# EAGLE design monitor-one-io-card-v0.0.4 (EAGLE 9.6.2)
Assembly variants: proto-click

## Sheet 1 of 2: SYSTEM BLOCK DIAGRAM
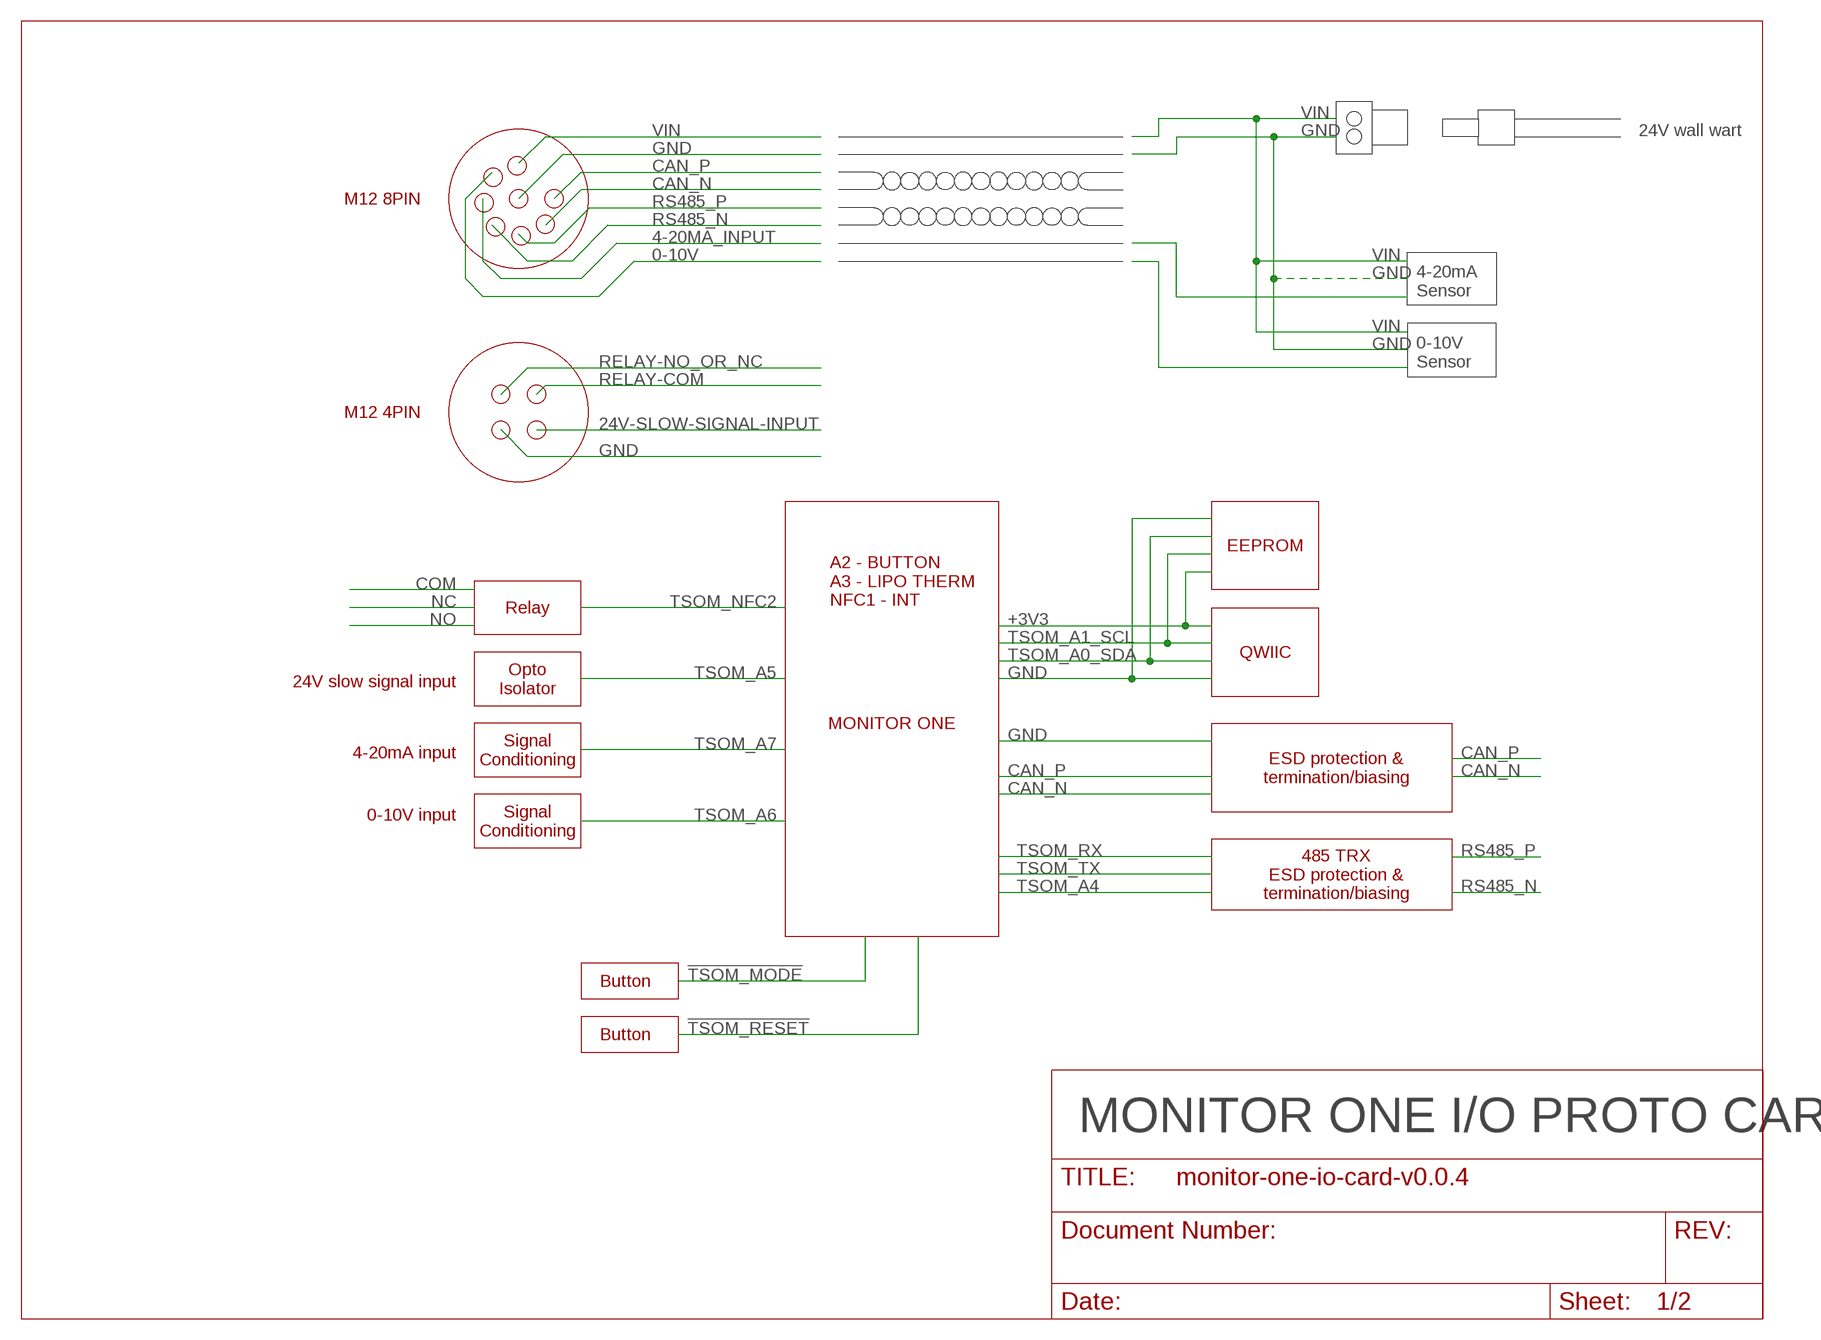
[diagram p0: schematic, sheet 1]

### Notes on the sheet
- 24V wall wart
- M12 8PIN
- 4-20mA
  Sensor
- 0-10V
  Sensor
- M12 4PIN
- EEPROM
- A2 - BUTTON
  A3 - LIPO THERM
  NFC1 - INT
- Relay
- QWIIC
- Opto
  Isolator
- 24V slow signal input
- MONITOR ONE
- Signal
  Conditioning
- 4-20mA input
- ESD protection &
  termination/biasing
- 0-10V input
- Signal
  Conditioning
- 485 TRX
  ESD protection &
  termination/biasing
- Button
- Button
- MONITOR ONE I/O PROTO CARD

## Sheet 2 of 2
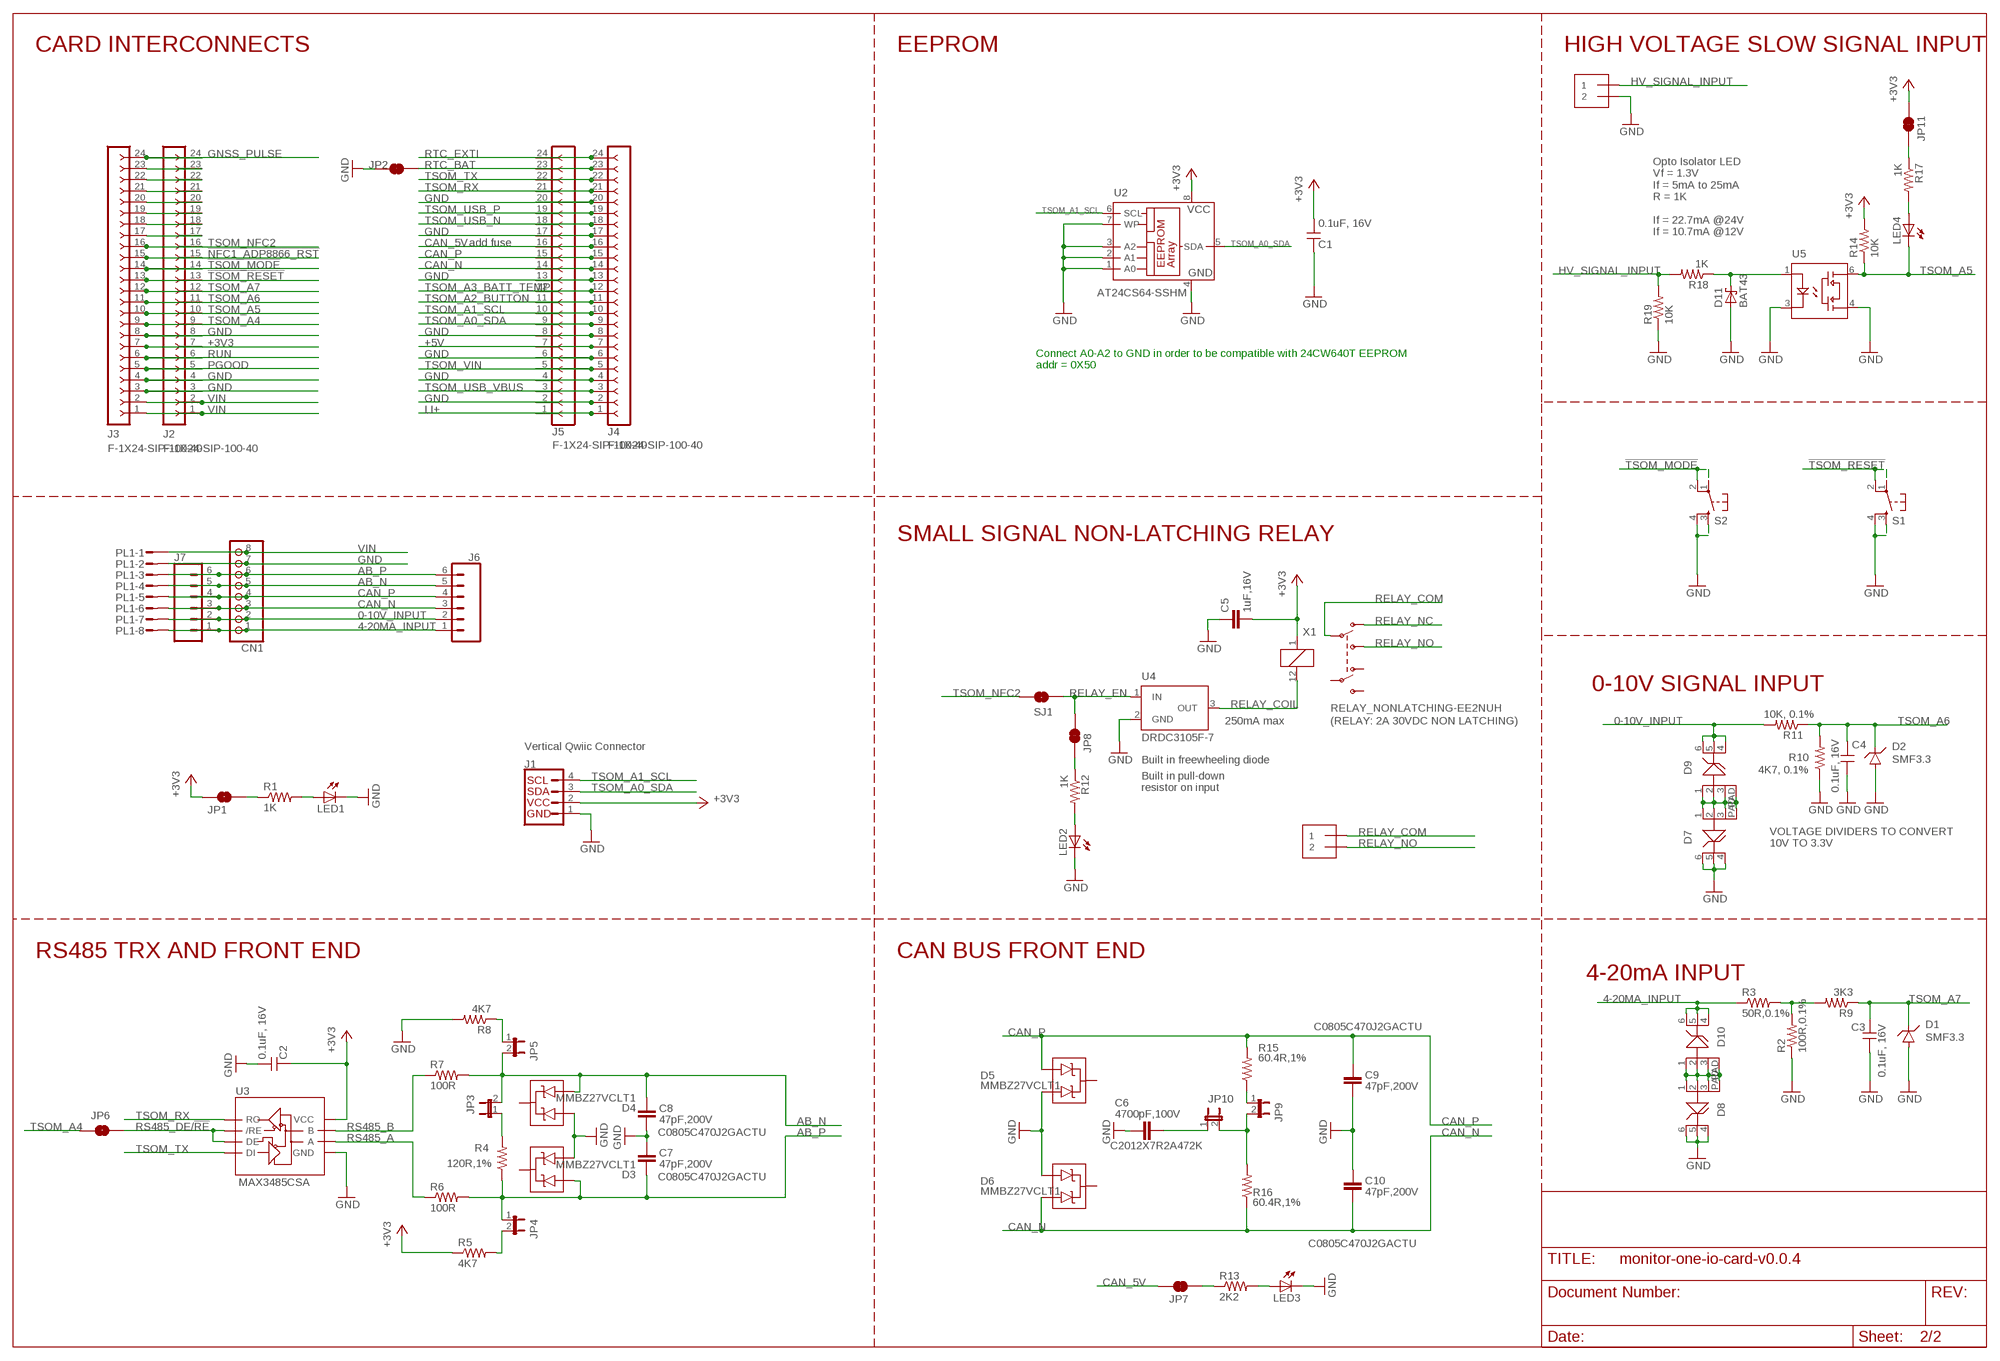
[diagram p1: schematic, sheet 2]

### Parts
C1  0.1uF, 16V  CAP_0.1UF_16V_0603  [C0603_P]  (not fitted in variant proto-click)
C2  0.1uF, 16V  CAP_0.1UF_16V_0603  [C0603_P]
C3  0.1uF, 16V  CAP_0.1UF_16V_0603  [C0603_P]
C4  0.1uF, 16V  CAP_0.1UF_16V_0603  [C0603_P]
C5  1uF,16V  C-EUC0805  [C0805]
C6  4700pF,100V  C-EUC0805  [C0805]  (not fitted in variant proto-click)
C7  47pF,200V  C-EUC0805  [C0805]
C8  47pF,200V  C-EUC0805  [C0805]
C9  47pF,200V  C-EUC0805  [C0805]
C10  47pF,200V  C-EUC0805  [C0805]
CN1  JST_8PIN  [JSTPH8]
D1  SMF3.3  TVS-DIODE-SOD123FL  [SOD-123FL]
D2  SMF3.3  TVS-DIODE-SOD123FL  [SOD-123FL]
D3  MMBZ27VCLT1  [SOT23-3]
D4  MMBZ27VCLT1  [SOT23-3]
D5  MMBZ27VCLT1  [SOT23-3]
D6  MMBZ27VCLT1  [SOT23-3]
D7  TVS3300DRVRNO-GND-VIAS  [WSON-6-NO-GND-VIAS]
D8  TVS3300DRVRNO-GND-VIAS  [WSON-6-NO-GND-VIAS]
D9  TVS3300DRVRNO-GND-VIAS  [WSON-6-NO-GND-VIAS]
D10  TVS3300DRVRNO-GND-VIAS  [WSON-6-NO-GND-VIAS]
D11  BAT43  SCHOTTKY_SOD-123  [SOD3718X135N]
J1  Vertical Qwiic Connector  QWIIC_CONNECTOR  [JST04_1MM_VERT]
J2  F-1X24-SIP-100-40  [SIP-100-24-40]
J3  F-1X24-SIP-100-40  [SIP-100-24-40]
J4  F-1X24-SIP-100-40  [SIP-100-24-40]
J5  F-1X24-SIP-100-40  [SIP-100-24-40]
J6  CONN_06NO_SILK_NO_POP  [1X06_NO_SILK]
J7  CONN_06NO_SILK_NO_POP  [1X06_NO_SILK]
J8  1X2-3.5MM  [1X2-3.5MM]
J9  1X2-3.5MM  [1X2-3.5MM]
JP1  JUMPER-SMT_2_NC_TRACE_NO-SILK  [SMT-JUMPER_2_NC_TRACE_NO-SILK]
JP2  JUMPER-SMT_2_NC_TRACE_NO-SILK  [SMT-JUMPER_2_NC_TRACE_NO-SILK]
JP3  JUMPER2  [JUMPER2]
JP4  JUMPER2  [JUMPER2]
JP5  JUMPER2  [JUMPER2]
JP6  JUMPER-SMT_2_NC_TRACE_NO-SILK  [SMT-JUMPER_2_NC_TRACE_NO-SILK]
JP7  JUMPER-SMT_2_NC_TRACE_NO-SILK  [SMT-JUMPER_2_NC_TRACE_NO-SILK]
JP8  JUMPER-SMT_2_NC_TRACE_NO-SILK  [SMT-JUMPER_2_NC_TRACE_NO-SILK]
JP9  JUMPER2  [JUMPER2]
JP10  JUMPER2  [JUMPER2]
JP11  JUMPER-SMT_2_NC_TRACE_NO-SILK  [SMT-JUMPER_2_NC_TRACE_NO-SILK]
LED1  LEDCHIP-LED0603  [CHIP-LED0603]
LED2  LEDCHIP-LED0603  [CHIP-LED0603]
LED3  LEDCHIP-LED0603  [CHIP-LED0603]
LED4  LEDCHIP-LED0603  [CHIP-LED0603]
PL1  DF3-08R  [DF3R-08]
R1  1K  RES_1K_0603  [R0603_P]
R2  100R,0.1%  R-US_R0805  [R0805]
R3  50R,0.1%  R-US_R0805  [R0805]
R4  120R,1%  R-US_R1206  [R1206]
R5  4K7  RES_4K7_0603  [R0603_P]  (not fitted in variant proto-click)
R6  100R  RES_0603  [R0603_P]
R7  100R  RES_0603  [R0603_P]
R8  4K7  RES_4K7_0603  [R0603_P]  (not fitted in variant proto-click)
R9  3K3  RES_0603  [R0603_P]
R10  4K7, 0.1%  RES_0603  [R0603_P]
R11  10K, 0.1%  RES_10K_0603  [R0603_P]
R12  1K  RES_1K_0603  [R0603_P]
R13  2K2  RES_2K2_0603  [R0603_P]
R14  10K  RES_10K_0603  [R0603_P]
R15  60.4R,1%  R-US_R1206  [R1206]  (not fitted in variant proto-click)
R16  60.4R,1%  R-US_R1206  [R1206]  (not fitted in variant proto-click)
R17  1K  RES_1K_0603  [R0603_P]
R18  1K  RES_1K_0603  [R0603_P]
R19  10K  RES_10K_0603  [R0603_P]
S1  TAC_SWITCHSMD  [TACTILE_SWITCH_SMD]
S2  TAC_SWITCHSMD  [TACTILE_SWITCH_SMD]
SJ1  JUMPER-SMT_2_NC_TRACE_NO-SILK  [SMT-JUMPER_2_NC_TRACE_NO-SILK]
U2  AT24CS64-SSHM  24AA01SN  [SO-08]  (not fitted in variant proto-click)
U3  MAX3485CSA  RS485SOIC  [SO08]
U4  DRDC3105F-7  [SOT23]
U5  U5  TLP172AM  [TLP172A]
X1  RELAY_NONLATCHING-EE2NUH  [RELAY_EE2_NOLATCH]

### Nets
0-10V_INPUT: CN1.2 D9.4(IN) D9.5(IN) D9.6(IN) J6.2 J7.2 PL1.7 R11.2
4-20MA_INPUT: CN1.1 D10.4(IN) D10.5(IN) D10.6(IN) J6.1 J7.1 PL1.8 R3.1 ; also sheet 1
!NFC1_ADP8866_RST: J2.15 J3.15
!TSOM_MODE: J2.14 J3.14 S2.1 S2.2 ; also sheet 1
!TSOM_RESET: J2.13 J3.13 S1.1 S1.2 ; also sheet 1
+3V3: C1.1 C2.2 C5.2 J1.2 J2.7 J3.7 JP1.1 JP11.2 R5.1 R14.2 U2.8(VCC) U3.8(VCC) X1.1 ; also sheet 1
+5V: J4.7 J5.7
AB_N: C8.1 CN1.5 D4.1(A1) J6.5 J7.5 JP3.2 JP5.2 PL1.4 R7.2
AB_P: C7.2 CN1.6 D3.2(A2) J6.6 J7.6 JP4.1 PL1.3 R4.1 R6.2
CAN_5V: J4.16 J5.16 JP7.1
CAN_N: C10.2 CN1.3 D6.1(A1) J4.14 J5.14 J6.3 J7.3 PL1.6 R16.1 ; also sheet 1
CAN_P: C9.1 CN1.4 D5.2(A2) J4.15 J5.15 J6.4 J7.4 PL1.5 R15.2 ; also sheet 1
GND: C1.2 C2.1 C3.1 C4.2 C5.1 C6.1 C7.1 C8.2 C9.2 C10.1 CN1.7 D1.A D2.A D3.1(A1) D4.2(A2) D5.1(A1) D6.2(A2) D7.4(IN) D7.5(IN) D7.6(IN) D8.4(IN) D8.5(IN) D8.6(IN) D11.A J1.1 J2.3 J2.4 J2.8 J3.3 J3.4 J3.8 J4.2 J4.4 J4.6 J4.8 J4.13 J4.17 J4.20 J5.2 J5.4 J5.6 J5.8 J5.13 J5.17 J5.20 J8.2 JP2.1 LED1.C LED2.C LED3.C PL1.2 R2.1 R8.2 R10.1 R19.1 S1.3 S1.4 S2.3 S2.4 U2.1(A0) U2.2(A1) U2.3(A2) U2.4(GND) U2.7(WP) U3.5(GND) U4.2(GND) U5.3 U5.4 ; also sheet 1
GNSS_PULSE: J2.24 J3.24
HV_SIGNAL_INPUT: J8.1 R18.2 R19.2
LI+: J4.1 J5.1
N$1: JP1.2 R1.1
N$2: JP7.2 R13.1
N$3: J2.17 J3.17
N$4: J2.18 J3.18
N$5: J2.19 J3.19
N$6: J2.20 J3.20
N$7: J2.21 J3.21
N$8: J2.22 J3.22
N$9: J2.23 J3.23
N$10: R2.2 R3.2 R9.2
N$11: LED1.A R1.2
N$12: LED3.A R13.2
N$16: JP9.2 JP10.2 R16.2
N$47: JP4.2 R5.2
N$49: JP9.1 R15.1
N$59: JP5.1 R8.1
N$72: JP3.1 R4.2
N$74: D11.K R18.1 U5.1
N$75: LED2.A R12.2
N$76: JP8.1 R12.1
N$77: LED4.A R17.2
N$78: JP11.1 R17.1
N$134: C6.2 JP10.1
N$169: D8.1(GND) D8.2(GND) D8.3(GND) D8.PAD D10.1(GND) D10.2(GND) D10.3(GND) D10.PAD
N$170: D7.1(GND) D7.2(GND) D7.3(GND) D7.PAD D9.1(GND) D9.2(GND) D9.3(GND) D9.PAD
PGOOD: J2.5 J3.5
RELAY_COIL: U4.3(OUT) X1.12
RELAY_COM: J9.1 X1.9(SW:P1)
RELAY_EN: JP8.2 SJ1.1 U4.1(IN)
RELAY_NC: X1.10(SW:O1)
RELAY_NO: J9.2 X1.8(SW:S1)
RS485_A: R6.1 U3.6(A)
RS485_B: R7.1 U3.7(B)
RS485_DE/!RE: JP6.2 U3.2(/RE) U3.3(DE)
RTC_BAT: J4.23 J5.23 JP2.2
RTC_EXTI: J4.24 J5.24
RUN: J2.6 J3.6
TSOM_A0_SDA: J1.3 J4.9 J5.9 U2.5(SDA) ; also sheet 1
TSOM_A1_SCL: J1.4 J4.10 J5.10 U2.6(SCL) ; also sheet 1
TSOM_A2_BUTTON: J4.11 J5.11
TSOM_A3_BATT_TEMP: J4.12 J5.12
TSOM_A4: J2.9 J3.9 JP6.1 ; also sheet 1
TSOM_A5: J2.10 J3.10 LED4.C R14.1 U5.6 ; also sheet 1
TSOM_A6: C4.1 D2.C J2.11 J3.11 R10.2 R11.1 ; also sheet 1
TSOM_A7: C3.2 D1.C J2.12 J3.12 R9.1 ; also sheet 1
TSOM_NFC2: J2.16 J3.16 SJ1.2 ; also sheet 1
TSOM_RX: J4.21 J5.21 U3.1(RO) ; also sheet 1
TSOM_TX: J4.22 J5.22 U3.4(DI) ; also sheet 1
TSOM_USB_N: J4.18 J5.18
TSOM_USB_P: J4.19 J5.19
TSOM_USB_VBUS: J4.3 J5.3
TSOM_VIN: J4.5 J5.5
VIN: CN1.8 J2.1 J2.2 J3.1 J3.2 PL1.1 ; also sheet 1
Unconnected: D3.3(C) D4.3(C) D5.3(C) D6.3(C) X1.3(SW:O2) X1.4(SW:P2) X1.5(SW:S2)

### Notes on the sheet
- CARD INTERCONNECTS | EEPROM | HIGH VOLTAGE SLOW SIGNAL INPUT
- Opto Isolator LED
  Vf = 1.3V
  If = 5mA to 25mA
  R = 1K
  
  If = 22.7mA @24V
  If = 10.7mA @12V
- add fuse
- Connect A0-A2 to GND in order to be compatible with 24CW640T EEPROM
  addr = 0X50
- SMALL SIGNAL NON-LATCHING RELAY
- 0-10V SIGNAL INPUT
- 250mA max | (RELAY: 2A 30VDC NON LATCHING)
- Built in freewheeling diode
- Built in pull-down 
  resistor on input
- VOLTAGE DIVIDERS TO CONVERT
  10V TO 3.3V
- RS485 TRX AND FRONT END | CAN BUS FRONT END
- 4-20mA INPUT

## Library data of the parts
C1-C4 = particle-studios:CAP_: Particle Capacitors; DESP: CAP CER 0.1UF 16V X7R 0603; MFG: FENGHUA; MPN: 0603B104K160NT; PPN: PT-200082
C5 = rcl:C-EU: CAPACITOR, European symbol; SPICEPREFIX: C
C6 = rcl:C-EU: CAPACITOR, European symbol; PART_NUMBER: C2012X7R2A472K; SPICEPREFIX: C
C7 C8 = rcl:C-EU: CAPACITOR, European symbol; PART_NUMBER: C0805C470J2GACTU; SPICEPREFIX: C
C9 C10 = rcl:C-EU: CAPACITOR, European symbol; DESP: CAP CER 47PF 200V 0805; MFG: KEMET; MPN: C0805C470J2GACTU; PART_NUMBER: C0805C470J2GACTU; PPN: PT-201188; SPICEPREFIX: C
CN1 = microbuilder:JST_8PIN: JST 8-Pin Right-Angle Connector
D1 D2 = particle-studios:TVS-DIODE-SOD123
D3 D4 = SparkFun:MMBZ27VCLT1
D5 D6 = SparkFun:MMBZ27VCLT1; DESP: TVS DIODE 22V 38V SOT23-3; MFG: ON SEMI; MPN: MMBZ27VCLT1; PPN: PT-201202
D7-D10 = particle-studios:TVS3300DRVR: Texas Instruments 33V Flat-Clamp Surge Protection Device
D11 = ipc-7351-diode:SCHOTTKY_
J1 = SparkFun-Connectors:QWIIC_CONNECTOR: SparkFun I2C Standard Qwiic Connector An SMD 1mm pitch JST connector makes it easy and quick (get it? Qwiic?) to connect I2C devices to each other. The Qwiic system <http://www.sparkfun.com/qwiic> enables fast and solderless connection between popular platforms and various sensors and actuators. We carry 200mm <https://www.sparkfun.com/products/14204>, 100mm <https://www.sparkfun.com/products/14205>, 50mm <https://www.sparkfun.com/products/14206>, and breadboard friendly <https://www.sparkfun.com/products/14207> Qwiic cables. We also offer 10 pcs strips <https://www.sparkfun.com/products/14323> the SMD connectors.; PROD_ID: CONN-14483
J2-J5 = con-headers-jp:F-1X24-: FEMALE HEADER
J6 J7 = SparkFun-Connectors:CONN_06: Multi connection point. Often used as Generic Header-pin footprint for 0.1 inch spaced/style header connections On any of the 0.1 inch spaced packages, you can populate with these: Break Away Headers - Straight <https://www.sparkfun.com/products/116> (PRT-00116) Break Away Male Headers - Right Angle <https://www.sparkfun.com/products/553> (PRT-00553) Female Headers <https://www.sparkfun.com/products/115> (PRT-00115) Break Away Headers - Machine Pin <https://www.sparkfun.com/products/117> (PRT-00117) Break Away Female Headers - Swiss Machine Pin <https://www.sparkfun.com/products/743> (PRT-00743) Arduino Stackable Header - 6 Pin <https://www.sparkfun.com/products/9280> (PRT-09280) For SCREWTERMINALS and SPRING TERMINALS visit here: Screw Terimnals on SparkFun.com <https://www.sparkfun.com/search/results?term=Screw+Terminals> (5mm/3.5mm/2.54mm spacing) This device is also useful as a general connection point to wire up your design to another part of your project. Our various solder wires solder well into these plated through hole pads. Hook-Up Wire - Assortment (Stranded, 22 AWG) <https://www.sparkfun.com/products/11375> (PRT-11375) Hook-Up Wire - Assortment (Solid Core, 22 AWG) <https://www.sparkfun.com/products/11367> (PRT-11367) View the entire wire category on our website here <https://www.sparkfun.com/categories/141>
J8 J9 = adafruit:1X2: 3.5mm Terminal block http://www.ladyada.net/library/pcb/eaglelibrary.html
JP1 JP2 JP6-JP8 JP11 SJ1 = SparkFun-Jumpers:JUMPER-SMT_2_NC_TRACE: Normally closed trace jumper This jumper has a trace between two pads so it's normally closed (NC). Use a razor knife to open the connection. For best results follow the IPC guidelines for cutting traces: Cutout at least 0.063 mm (0.005 in). Remove all loose material to clean up the cut area. Seal the cut with an approved epoxy. Reapply solder to reclose the connection.
JP3-JP5 JP9 JP10 = microbuilder:JUMPER2: JUMPER - 2 Pins
LED1-LED4 = adafruit:LED: LED OSRAM: - CHIPLED LG R971, LG N971, LY N971, LG Q971, LY Q971, LO R971, LY R971 LH N974, LH R974 LS Q976, LO Q976, LY Q976 LO Q996 - Hyper CHIPLED LW Q18S LB Q993, LB Q99A, LB R99A - SideLED LS A670, LO A670, LY A670, LG A670, LP A670 LB A673, LV A673, LT A673, LW A673 LH A674 LY A675 LS A676, LA A676, LO A676, LY A676, LW A676 LS A679, LY A679, LG A679 - Hyper Micro SIDELED® LS Y876, LA Y876, LO Y876, LY Y876 LT Y87S - SmartLED LW L88C, LW L88S LB L89C, LB L89S, LG L890 LS L89K, LO L89K, LY L89K LS L896, LA L896, LO L896, LY L896 - TOPLED LS T670, LO T670, LY T670, LG T670, LP T670 LSG T670, LSP T670, LSY T670, LOP T670, LYG T670 LG T671, LOG T671, LSG T671 LB T673, LV T673, LT T673, LW T673 LH T674 LS T676, LA T676, LO T676, LY T676, LB T676, LH T676, LSB T676, LW T676 LB T67C, LV T67C, LT T67C, LS T67K, LO T67K, LY T67K, LW E67C LS E67B, LA E67B, LO E67B, LY E67B, LB E67C, LV E67C, LT E67C LW T67C LS T679, LY T679, LG T679 LS T770, LO T770, LY T770, LG T770, LP T770 LB T773, LV T773, LT T773, LW T773 LH T774 LS E675, LA E675, LY E675, LS T675 LS T776, LA T776, LO T776, LY T776, LB T776 LHGB T686 LT T68C, LB T68C - Hyper Mini TOPLED® LB M676 - Mini TOPLED Santana® LG M470 LS M47K, LO M47K, LY M47K Source: http://www.osram.convergy.de/
PL1 = con-hirose-df3:DF3-08: Single row connector 2mm 8 way
R1 R12 R17 R18 = particle-studios:RES_: Particle Resistors; DESP: RES SMD 1K OHM 1% 1/10W 0603; MFG: FENGHUA; MPN: RC-03K102FT; PPN: PT-200135
R2-R4 = rcl:R-US_: RESISTOR, American symbol; SPICEPREFIX: R
R5 R8 = particle-studios:RES_: Particle Resistors; DESP: RES SMD 4K7 OHM 1% 1/10W 0603; MFG: YAGEO; MPN: RC0603FR-074K7L; PPN: PT-201085
R6 R7 R9 R10 = particle-studios:RES_: Particle Resistors
R11 = particle-studios:RES_: Particle Resistors; DESP: RES SMD 10K OHM 1% 1/10W 0603; MFG: YAGEO; MPN: RC0603FR-0710KL; PPN: PT-200477; VALUE: 10K
R13 = particle-studios:RES_: Particle Resistors; DESP: RES SMD 2K2 OHM 1% 1/10W 0603
R14 R19 = particle-studios:RES_: Particle Resistors; DESP: RES SMD 10K OHM 1% 1/10W 0603; MFG: YAGEO; MPN: RC0603FR-0710KL; PPN: PT-200477
R15 R16 = rcl:R-US_: RESISTOR, American symbol; DESP: RES SMD 60.4 OHM 1% 1/4W 1206; SPICEPREFIX: R
S1 S2 = particle-studios:TAC_SWITCH: SMD Tactiile Switch
U2 = microchip:24*: Serial EEPROM I2C; MF: MICROCHIP; MPN: 24AA01/SN; OC_FARNELL: 1331268; OC_NEWARK: 89C9792
U3 = SparkFun-IC-Comms:RS485: RS-485 Transceiver SP3485 Series 8 Pin NSOIC 3.3 V Low Power Half Duplex RS-485 Transceiver MAX3485 compatible Datasheet <http://www.sparkfun.com/datasheets/Components/General/sp3485CN-LTR.pdf> SparkFun Products SparkFun Transceiver Breakout - RS-485 <https://www.sparkfun.com/products/10124> (BOB-10124) SparkFun USB to RS-485 Converter <https://www.sparkfun.com/products/9822> (BOB-09822); PROD_ID: IC-09388
U4 = particle-studios:DRDC3105F-7: IC PWR DRIVER BIPOLAR 1:1 SOT23
U5 = particle-studios:TLP172A: OPTO SSR RELAY SPST-NO 500MA 0-60V
X1 = microbuilder:RELAY_NONLATCHING

## Net classes
1 USB: width 0.483 mm, clearance 0.152 mm
3 CAN: width 0.483 mm, clearance 0.152 mm

## Board
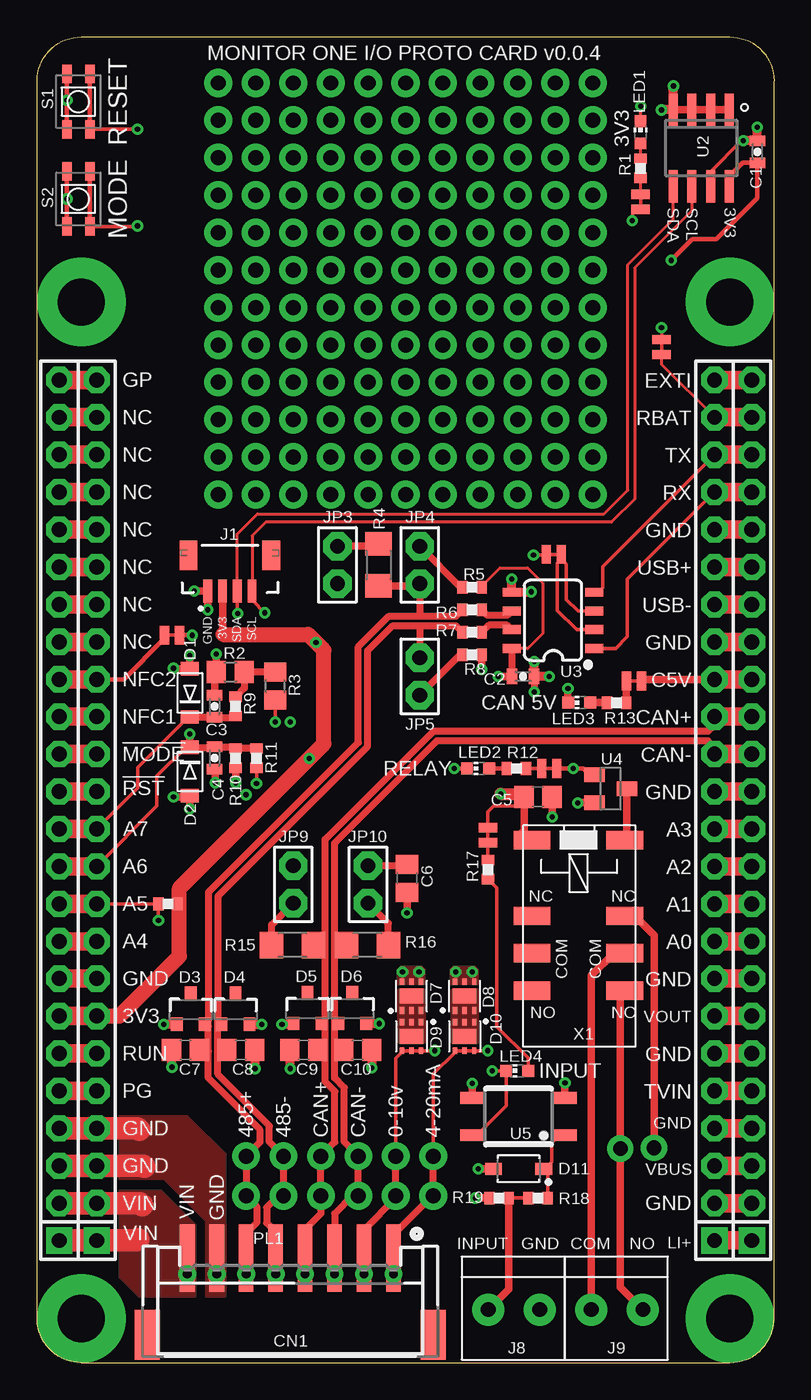
[diagram p2: board, top side]
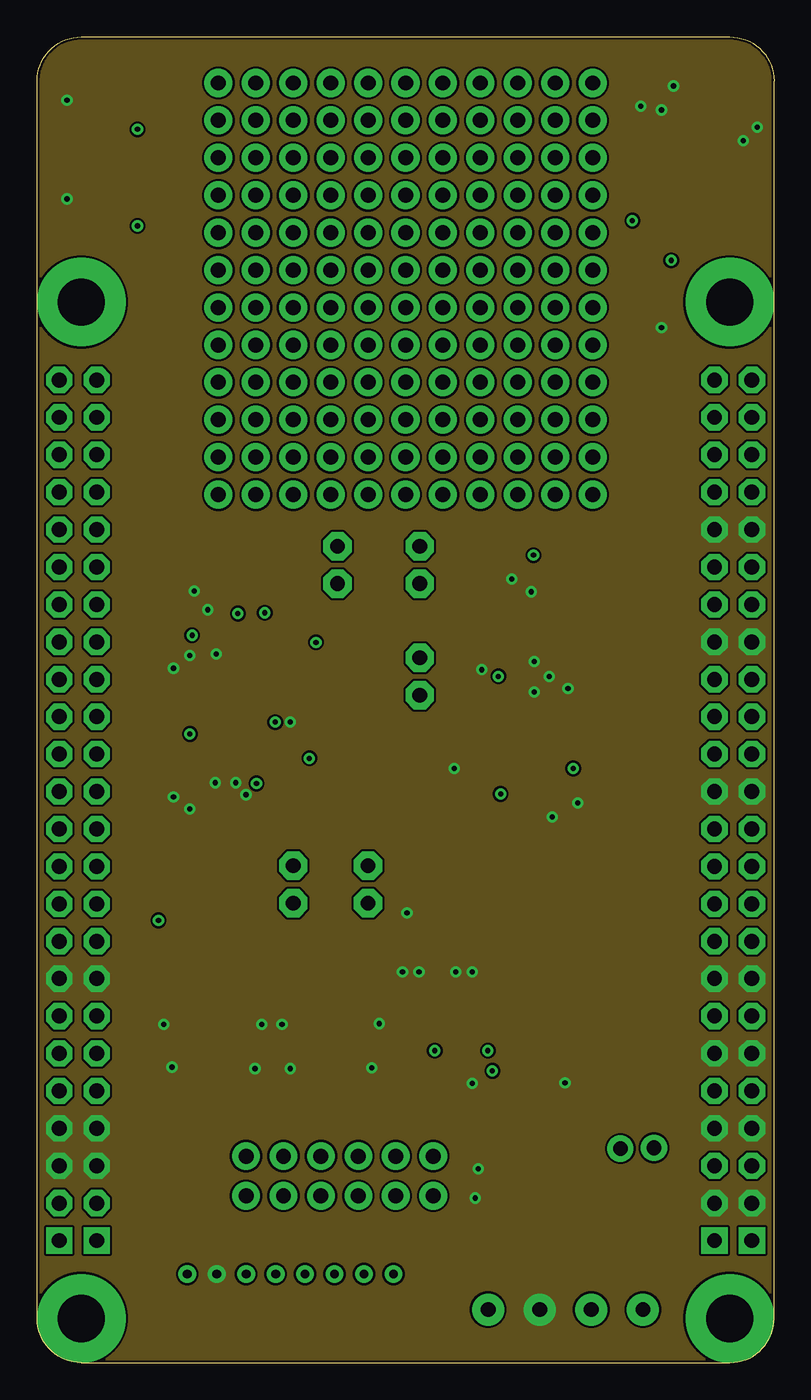
[diagram p3: board, inner layer Route2]
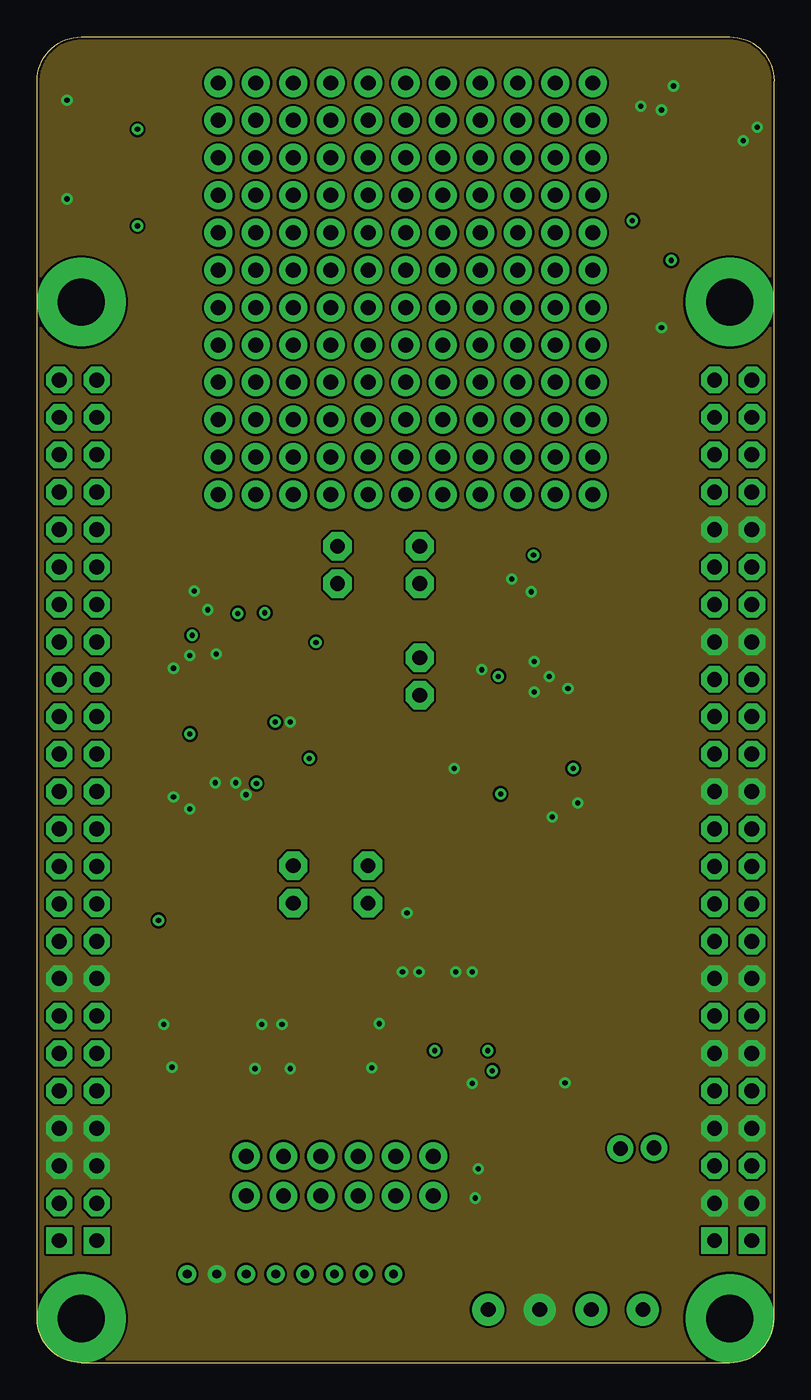
[diagram p4: board, inner layer Route15]
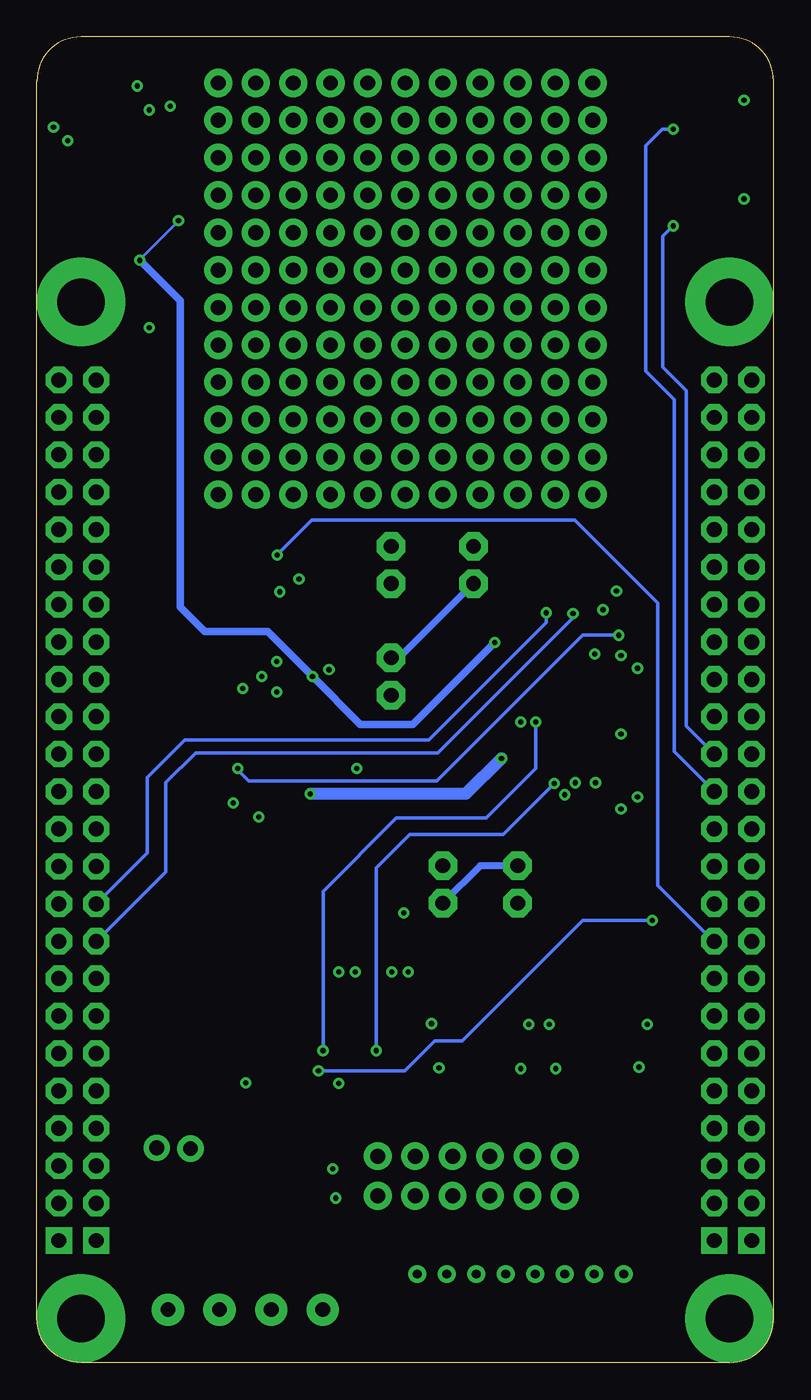
[diagram p5: board, bottom side, seen from below]

Size 50 x 90 mm. Coordinates in mm from the lower left corner, seen from the top.
Outline: 3,0 47,0 arc90 50,3 50,87 arc90 47,90 3,90 arc90 0,87 0,3 arc90 3,0
Copper layers (1+2*15+16): Top 0.018mm / dielectric 0.195mm / Route2 0.035mm / dielectric 1.1mm / Route15 0.035mm / dielectric 0.195mm / Bottom 0.018mm
Design rules "particle-4layer *": minimum track width 6mil, minimum drill 0.3mm, track to track 6mil, track to pad 6mil, pad to pad 6mil, via to via 6mil, smd to smd 0mil, copper to edge 6mil, drill to drill 6mil, minimum pad ring 12mil, minimum via ring 8mil, stop-mask expansion 0mil, vias tented up to drill 20mil, thermal gap 8mil

### Footprints (pad centres in the part's own frame; a part is rotated, then mirrored left to right if it is on the bottom)
C0603_P = smd 0.711 x 1.041: 1 -0.749,0; 2 0.749,0
C0805 = smd 1.3 x 1.5: 1 -0.95,0; 2 0.95,0
JSTPH8 = smd 1 x 4.6: 1 -7,-3.7; 2 -5,-3.7; 3 -3,-3.7; 4 -1,-3.7; 5 1,-3.7; 6 3,-3.7; 7 5,-3.7; 8 7,-3.7 | smd 1.7 x 3.4: NC1 -9.7,1.5; NC2 9.7,1.5
SOD-123FL = smd 0.91 x 1.22: A 1.637,0; C -1.637,0
SOT23-3 = smd 0.8 x 0.9: 1 -0.95,-1; 2 0.95,-1; 3 0,1.1
WSON-6-NO-GND-VIAS = smd 0.45 x 0.3: 1 -0.975,0.65; 2 -0.975,0; 3 -0.975,-0.65; 4 0.975,-0.65; 5 0.975,0; 6 0.975,0.65 | smd 1 x 1.6: PAD 0,0
SOD3718X135N = smd 1.15 x 0.8: A 1.7,0; K -1.7,0
JST04_1MM_VERT = smd 0.6 x 1.55: 1 -1.478,0.775; 2 -0.478,0.775; 3 0.522,0.775; 4 1.522,0.775 | smd 1.2 x 2: NC1 -2.778,3.2; NC2 2.822,3.2
SIP-100-24-40 = drill 1.016 pad 1.778 square: 1 -29.21,0 | drill 1.016 pad 1.778 octagon: 2 -26.67,0; 3 -24.13,0; 4 -21.59,0; 5 -19.05,0; 6 -16.51,0; 7 -13.97,0; 8 -11.43,0; 9 -8.89,0; 10 -6.35,0; 11 -3.81,0; 12 -1.27,0; 13 1.27,0; 14 3.81,0; 15 6.35,0; 16 8.89,0; 17 11.43,0; 18 13.97,0; 19 16.51,0; 20 19.05,0; 21 21.59,0; 22 24.13,0; 23 26.67,0; 24 29.21,0
1X06_NO_SILK = drill 1.016 pad 1.88: 1 0,0; 2 2.54,0; 3 5.08,0; 4 7.62,0; 5 10.16,0; 6 12.7,0
1X2-3.5MM = drill 1 pad 2.184: 1 1.8,0; 2 -1.7,0
SMT-JUMPER_2_NC_TRACE_NO-SILK = smd 0.635 x 1.27: 1 -0.508,0; 2 0.508,0
JUMPER2 = drill 1 pad 1.93 octagon: 1 2.54,0; 2 0,0
CHIP-LED0603 = smd 0.8 x 0.8: A 0,-0.75; C 0,0.75
DF3R-08 = drill 0.6: 1 -7,1.8; 2 -5,1.8; 3 -3,1.8; 4 -1,1.8; 5 1,1.8; 6 3,1.8; 7 5,1.8; 8 7,1.8
R0603_P = smd 0.7 x 0.85: 1 -0.65,0; 2 0.65,0
R0805 = smd 1.3 x 1.5: 1 -0.95,0; 2 0.95,0
R1206 = smd 1.6 x 1.803: 1 -1.422,0; 2 1.422,0
TACTILE_SWITCH_SMD = smd 1.25 x 0.65: 1 -1.875,0.775; 2 1.875,0.775; 3 -1.875,-0.775; 4 1.875,-0.775
SO-08 = smd 0.6 x 2.2: 1 -1.905,-2.6; 2 -0.635,-2.6; 3 0.635,-2.6; 4 1.905,-2.6; 5 1.905,2.6; 6 0.635,2.6; 7 -0.635,2.6; 8 -1.905,2.6
SO08 = smd 0.6 x 1.2: 1 -1.905,-2.8; 2 -0.635,-2.8; 3 0.635,-2.8; 4 1.905,-2.8; 5 1.905,2.8; 6 0.635,2.8; 7 -0.635,2.8; 8 -1.905,2.8
SOT23 = smd 1 x 1.4: 1 -0.95,-1.1; 2 0.95,-1.1; 3 0,1.1
TLP172A = smd 1.6 x 0.8: 1 -3.15,1.27; 3 -3.15,-1.27; 4 3.15,-1.27; 6 3.15,1.27
RELAY_EE2_NOLATCH = smd 1.25 x 2.5: 1 -6.5,-3.15; 3 -1.37,-3.15; 4 1.17,-3.15; 5 3.71,-3.15; 8 3.71,3.15; 9 1.17,3.15; 10 -1.37,3.15; 12 -6.5,3.15

### Placement (x,y rotation side)
C1  48.87,82.19 90 top
C2  32.97,46.58 180 top
C3  12.04,44.55 270 top
C4  12.04,41.05 270 top
C5  33.99,38.4 180 top
C6  25.1,32.87 90 top
C7  10.06,21.23 0 top
C8  13.82,21.23 0 top
C9  18.08,21.23 180 top
C10  21.74,21.23 180 top
CN1  17.18,3.4 180 top
D1  10.36,45.47 90 top
D2  10.36,40.13 270 top
D3  10.41,23.98 0 top
D4  13.46,23.98 0 top
D5  18.34,24.03 0 top
D6  21.39,24.03 0 top
D7  25.4,24.89 90 top
D8  29.01,24.89 90 top
D9  25.4,22.15 270 top
D10  29.01,22.15 270 top
D11  32.66,13.16 180 top
J1  13.06,51.61 0 top
J2  1.5,37.5 90 top
J3  4.04,37.5 90 top
J4  45.96,37.5 90 top
J5  48.5,37.5 90 top
J6  26.87,14.02 180 top
J7  26.87,11.33 180 top
J8  32.4,3.6 180 top
J9  39.4,3.6 180 top
JP1  40.94,78.79 90 top
JP2  42.37,68.94 270 top
JP3  20.37,52.88 90 top
JP4  25.96,55.42 270 top
JP5  25.96,47.85 270 top
JP6  35.05,54.86 0 top
JP7  40.49,46.28 180 top
JP8  34.75,40.34 0 top
JP9  17.37,33.73 270 top
JP10  22.45,31.19 90 top
JP11  30.58,35.81 90 top
LED1  40.94,83.52 0 top
LED2  29.92,40.34 90 top
LED3  36.78,44.81 90 top
LED4  32.56,19.81 90 top
PL1  17.18,4.22 0 top
R1  40.94,81.08 90 top
R2  13.11,46.89 0 top
R3  16.15,45.92 90 top
R4  23.16,54.15 90 top
R5  29.51,52.63 180 top
R6  29.51,51.1 180 top
R7  29.51,49.58 180 top
R8  29.51,48.06 0 top
R9  13.46,44.55 90 top
R10  13.46,41.05 90 top
R11  14.88,41.05 270 top
R12  32.51,40.34 180 top
R13  39.32,44.81 180 top
R14  8.89,31.14 0 top
R15  17.32,28.35 0 top
R16  22.4,28.35 0 top
R17  30.58,33.48 270 top
R18  33.99,11.18 180 top
R19  31.34,11.18 0 top
S1  2.79,85.6 270 top
S2  2.79,78.99 270 top
SJ1  9.14,49.38 180 top
U2  45.06,82.45 180 top
U3  35,50.39 90 top
U4  38.91,38.96 270 top
U5  32.66,16.71 180 top
X1  36.73,28.96 270 top

### Tracks (layer width: path | path; a pad name or v marks a point on that pad's centre or on a via)
0-10V_INPUT  (via drill 0.35)
  Top 0.254: J6.2 24.33,20.66 24.75,21.07 D9.4 D9.5 D9.6 v26.96,21.17 v26.98,21.18 | v14.88,39.32 R11.2
  Top 0.483: CN1.2 22.18,9.02 24.33,11.18 J7.2 J6.2
  Top 0.61: CN1.2 PL1.7
  Bottom 0.254: v26.98,21.18 26.98,33.58 24.69,35.87 18.34,35.87 v14.88,39.32
4-20MA_INPUT  (via drill 0.35)
  Top 0.254: J6.1 26.87,19.59 28.36,21.07 D10.4 D10.5 D10.6 v30.57,21.17 v30.58,21.18 | R3.1 v16.15,43.48
  Top 0.483: CN1.1 24.18,8.68 26.82,11.33 J7.1 J6.1
  Top 0.61: CN1.1 PL1.8
  Bottom 0.254: v16.15,43.48 16.15,40.34 19.51,36.98 25.6,36.98 30.58,32 v30.58,21.18
!NFC1_ADP8866_RST
  Top 1.27: J2.15 J3.15
!TSOM_MODE  (via drill 0.35)
  Top 0.254: v6.81,77.17 6.76,77.12 S2.2
  Top 0.305: S2.1 S2.2
  Top 1.27: J2.14 J3.14
  Bottom 0.254: J3.14 5.94,43.21 5.94,65.99 7.52,67.56 7.52,76.45 v6.81,77.17
!TSOM_RESET  (via drill 0.35)
  Top 0.254: v6.81,83.72 S1.2
  Top 0.305: S1.1 S1.2
  Top 1.27: J2.13 J3.13
  Bottom 0.254: J3.13 6.76,41.49 6.76,65.38 8.69,67.31 8.69,82.6 7.57,83.72 v6.81,83.72
+3V3  (via drill 0.35)
  Top 0.203: JP1.1 40.69,78.28 40.39,77.98 v40.39,77.52 | R5.1 30.16,52.72 31.39,53.95 33.27,53.95 34.29,52.93 34.29,49.48 33.27,48.46 32.2,48.46
  Top 0.254: JP11.2 30.58,37.39 30.99,37.8 32.43,37.8 C5.2 | R14.2 9.65,31.25 9.65,32.21 | 12.58,49.45 12.6,49.43
  Top 0.305: C1.1 48.82,81.44 | v43.03,74.83 44.45,76.25 46.08,76.25 48.87,79.05 C1.1 | C1.1 47.87,81.44 46.97,80.54 U2.8
  Top 0.483: U3.8 32.2,48.46 32.2,46.6 C2.2
  Top 0.508: C5.2 33.03,36.13 32.87,35.97 33.07,35.97 X1.1 | v31.29,46.58 32.2,46.58 32.2,46.6 | J1.2 12.58,49.45
  Top 0.813: v31.45,38.61 32.83,38.61 C5.2
  Top 1.016: J3.7 5.6,23.53 9.65,27.58 9.65,32.21 v18.47,41.02 19.46,42.01 19.46,48.36 v18.92,48.9 18.39,49.43 12.6,49.43
  Top 1.27: J2.7 J3.7
  Bottom 0.203: v43.03,74.83 43.05,74.85 v40.39,77.52
  Bottom 0.508: v43.03,74.83 40.28,72.08 40.28,51.31 38.61,49.63 34.34,49.63 v31.29,46.58 28.04,43.33 24.49,43.33 v18.92,48.9
  Bottom 0.813: v31.45,38.61 20.88,38.61 v18.47,41.02
+5V
  Top 1.27: J4.7 J5.7
AB_N
  Top 0.483: 12.26,23.23 12.26,31.66 22.43,41.83 22.43,48.34 24.13,50.04 25.96,50.04 | 12.26,23.23 D4.1 12.5,22.96 12.26,22.96 | 25.96,50.04 JP5.2 | 12.26,21.18 12.26,19.57 15.76,16.07 15.76,14.97 J6.5 J7.5 16.36,11.33 15.57,10.54 15.57,9.49 16.18,8.88 CN1.5 | 12.26,21.18 12.26,22.96 | 12.26,22.96 12.26,23.23 | C8.1 12.82,21.18 12.26,21.18 | 25.96,50.04 28.41,50.04 R7.2
  Top 0.61: CN1.5 PL1.4
  Bottom 0.483: JP5.2 25.4,47.85 JP3.2
AB_P
  Top 0.483: 11.61,23.22 D3.2 11.49,22.98 11.61,22.86 | 25.96,50.67 23.87,50.67 21.79,48.6 21.79,42.1 11.62,31.92 11.62,23.23 11.61,23.22 | JP4.1 25.96,50.67 | 11.61,21.13 11.61,19.32 15.13,15.8 15.13,14.97 J6.6 J7.6 14.89,10.61 14.89,9.49 14.18,8.78 CN1.6 | 11.61,21.13 11.61,22.86 | 11.61,22.86 11.61,23.22 | C7.2 11.51,21.23 11.61,21.13 | 25.96,50.67 28.43,50.67 R6.2
  Top 0.508: JP4.1 25.81,52.73 R4.1
  Top 0.61: CN1.6 PL1.3
CAN_5V
  Top 0.508: JP7.1 41.11,46.39 J4.16
  Top 1.27: J4.16 J5.16
CAN_N
  Top 0.483: J4.14 45.96,41.77 45.52,42.22 27.13,42.22 20.18,35.27 20.18,28.25 | 20.18,21.18 20.18,19.33 20.84,18.66 20.84,14.97 J6.3 J7.3 21.39,11.33 20.18,10.12 CN1.3 | 20.18,21.18 20.18,23.01 | 20.18,23.01 20.18,28.25 | C10.2 20.74,21.18 20.18,21.18 | D6.1 20.42,23.01 20.18,23.01 | R16.1 20.88,28.25 20.18,28.25
  Top 0.61: CN1.3 PL1.6
  Top 1.27: J4.14 J5.14
CAN_P
  Top 0.483: J4.15 45.96,43.29 45.52,42.85 26.86,42.85 19.55,35.53 19.55,28.25 | 19.55,21.18 19.55,19.06 20.21,18.4 20.21,14.97 J6.4 J7.4 19.25,10.11 18.23,9.08 18.23,7.15 CN1.4 | 19.55,21.18 19.55,22.91 | 19.55,22.91 19.55,28.25 | C9.1 19.49,21.23 19.55,21.18 | D5.2 19.43,23.03 19.55,22.91 | R15.2 19.44,28.35 19.55,28.25
  Top 0.61: CN1.4 PL1.5
  Top 1.27: J4.15 J5.15
GND  (via drill 0.35)
  Top 0.203: LED1.C v40.95,85.29 | v42.37,70.26 JP2.1
  Top 0.254: U2.7 45.7,80.85 47.79,82.94 47.92,82.94
  Top 0.305: S1.3 v2.02,85.7 S1.4 | S2.3 v2.02,78.99 S2.4 | LED2.C v28.3,40.34
  Top 0.483: C2.1 33.72,45.53 v33.73,45.52
  Top 0.508: v10.36,48.01 D1.A 9.28,47.1 v9.25,47.14 | v12.14,48.11 12.16,48.09 R2.1 12.04,46.77 C3.1 | C4.2 12.09,40.25 v12.09,39.37 | R10.1 v13.46,39.37 | v10.36,37.59 D2.A 10.27,38.41 v9.25,38.41 | U4.2 36.69,38.01 v36.68,38 | C6.1 v25.09,30.53 | v10.67,52.38 10.68,52.39 J1.1 v11.58,51.11 v11.58,51.1 | LED3.C 36.02,44.82 v36.02,45.77 | R19.1 v29.72,11.18 | D11.A v29.92,13.16 | U5.4 v29.51,18.95 v29.52,18.95 | U5.3 v35.81,19 | v35.81,19 | C5.1 34.94,37.05 v34.95,37.03 | v42.38,85.05 U2.3 U2.2 U2.1 | R8.2 30.18,48.05 v30.18,47.04
  Top 0.61: v48.87,83.87 C1.2 47.92,82.94 v47.9,82.96 | v32.21,53.19 v32.2,53.18 U3.5 33.5,52.3 v33.53,52.32 | v34.75,46.58 C2.1 33.72,47.59 v33.73,47.6 | C8.2 14.77,19.98 v14.78,19.96 | v15.24,22.96 15.22,22.98 D4.2 | D3.1 8.6,22.98 v8.59,22.96 | C9.2 17.14,20 v17.17,19.96 | C10.1 22.69,20.03 v22.71,20.02 | D5.1 17.34,22.98 16.63,22.98 v16.61,22.96 | v23.22,23.01 23.2,23.03 D6.2 | v42.37,85.04 v42.38,85.05 U2.4 43.16,86.64 v43.18,86.67 | v9.14,20.07 9.14,21.17 9.09,21.22 C7.1 | CN1.7 PL1.2
  Top 1.27: J2.8 J3.8 | J4.2 J5.2 | J4.4 J5.4 | J4.6 J5.6 | J4.8 J5.8 | J4.13 J5.13 | J4.17 J5.17 | J4.20 J5.20
  Top 1.524: J2.4 J3.4 6.8,15.91 6.91,15.8 | J2.3 J3.3 7.2,13.37 7.26,13.31
  other vias: 24.79,26.52 25.91,26.52 28.4,26.52 29.51,26.52 14.17,38.56 17.17,43.48
  pour Route2 (no thermals): 0,0 0,90.17 52.07,90.17 52.07,0
  pour Route15 (no thermals): 0,0 53.34,0 53.34,90.17 0,90.17
  pour Top (no thermals): 5.59,12.45 5.59,16.76 10.16,16.76 12.75,14.17 12.75,4.47 11.48,4.47 11.48,9.6 8.64,12.45
  pour Top (no thermals): 24.43,25.7 26.31,25.7 26.31,26.67 26.11,26.87 24.64,26.87 24.43,26.67
  pour Top (no thermals): 28.04,25.7 29.92,25.7 29.92,26.67 29.72,26.87 28.24,26.87 28.04,26.67
GNSS_PULSE
  Top 1.27: J2.24 J3.24
HV_SIGNAL_INPUT
  Top 0.152: J8.1 30.5,3.5
  Top 0.254: R18.2 R19.2
  Top 0.508: R19.2 31.99,4.99 30.5,3.5
LI+
  Top 1.27: J4.1 J5.1
N$1
  Top 0.203: JP1.2 R1.1
N$2
  Top 0.203: R13.1
  Top 0.508: JP7.2 R13.1
N$3
  Top 1.27: J2.17 J3.17
N$4
  Top 1.27: J2.18 J3.18
N$5
  Top 1.27: J2.19 J3.19
N$6
  Top 1.27: J2.20 J3.20
N$7
  Top 1.27: J2.21 J3.21
N$8
  Top 1.27: J2.22 J3.22
N$9
  Top 1.27: J2.23 J3.23
N$10
  Top 0.483: R9.2 14.06,45.8 R2.2 16.14,46.89 R3.2
N$11
  Top 0.203: R1.2 LED1.A
N$12
  Top 0.508: LED3.A R13.2
N$15  (via drill 1.02 pad 1.91)
  other vias: 12.29,79.25
N$16
  Top 0.483: R16.2 23.82,29.82 JP10.2
  Bottom 0.483: JP9.2 19.91,33.73 JP10.2
N$17  (via drill 1.02 pad 1.91)
  other vias: 12.29,81.79
N$18  (via drill 1.02 pad 1.91)
  other vias: 12.29,84.33
N$19  (via drill 1.02 pad 1.91)
  other vias: 12.29,86.87
N$20  (via drill 1.02 pad 1.91)
  other vias: 14.83,86.87
N$21  (via drill 3.2 pad 6)
  other vias: 3,3
N$22  (via drill 1.02 pad 1.91)
  other vias: 14.83,84.33
N$23  (via drill 3.2 pad 6)
  other vias: 47,3
N$24  (via drill 3.2 pad 6)
  other vias: 3,72
N$25  (via drill 1.02 pad 1.91)
  other vias: 14.83,81.79
N$26  (via drill 1.02 pad 1.91)
  other vias: 14.83,79.25
N$27  (via drill 3.2 pad 6)
  other vias: 47,72
N$30  (via drill 1.02 pad 1.91)
  other vias: 17.37,79.25
N$31  (via drill 1.02 pad 1.91)
  other vias: 17.37,81.79
N$32  (via drill 1.02 pad 1.91)
  other vias: 17.37,84.33
N$33  (via drill 1.02 pad 1.91)
  other vias: 17.37,86.87
N$34  (via drill 1.02 pad 1.91)
  other vias: 19.91,86.87
N$35  (via drill 1.02 pad 1.91)
  other vias: 19.91,84.33
N$36  (via drill 1.02 pad 1.91)
  other vias: 19.91,81.79
N$37  (via drill 1.02 pad 1.91)
  other vias: 19.91,79.25
N$40  (via drill 1.02 pad 1.91)
  other vias: 22.45,79.25
N$41  (via drill 1.02 pad 1.91)
  other vias: 22.45,81.79
N$42  (via drill 1.02 pad 1.91)
  other vias: 22.45,84.33
N$43  (via drill 1.02 pad 1.91)
  other vias: 22.45,86.87
N$44  (via drill 1.02 pad 1.91)
  other vias: 24.99,86.87
N$45  (via drill 1.02 pad 1.91)
  other vias: 24.99,84.33
N$46  (via drill 1.02 pad 1.91)
  other vias: 24.99,81.79
N$47
  Top 0.483: R5.2 28.75,52.63 JP4.2
N$48  (via drill 1.02 pad 1.91)
  other vias: 24.99,79.25
N$49
  Top 0.483: R15.1 15.9,29.72 JP9.1
N$50  (via drill 1.02 pad 1.91)
  other vias: 12.29,64.01
N$51  (via drill 1.02 pad 1.91)
  other vias: 27.53,79.25
N$52  (via drill 1.02 pad 1.91)
  other vias: 27.53,81.79
N$53  (via drill 1.02 pad 1.91)
  other vias: 27.53,84.33
N$54  (via drill 1.02 pad 1.91)
  other vias: 27.53,86.87
N$55  (via drill 1.02 pad 1.91)
  other vias: 30.07,86.87
N$56  (via drill 1.02 pad 1.91)
  other vias: 30.07,84.33
N$57  (via drill 1.02 pad 1.91)
  other vias: 30.07,81.79
N$58  (via drill 1.02 pad 1.91)
  other vias: 30.07,79.25
N$59
  Top 0.483: R8.1 28.7,48.06 JP5.1
N$60  (via drill 1.02 pad 1.91)
  other vias: 32.61,86.87
N$61  (via drill 1.02 pad 1.91)
  other vias: 35.15,86.87
N$62  (via drill 1.02 pad 1.91)
  other vias: 37.69,86.87
N$63  (via drill 1.02 pad 1.91)
  other vias: 37.69,84.33
N$64  (via drill 1.02 pad 1.91)
  other vias: 37.69,81.79
N$65  (via drill 1.02 pad 1.91)
  other vias: 37.69,79.25
N$66  (via drill 1.02 pad 1.91)
  other vias: 35.15,79.25
N$67  (via drill 1.02 pad 1.91)
  other vias: 35.15,81.79
N$68  (via drill 1.02 pad 1.91)
  other vias: 35.15,84.33
N$69  (via drill 1.02 pad 1.91)
  other vias: 32.61,84.33
N$70  (via drill 1.02 pad 1.91)
  other vias: 32.61,81.79
N$71  (via drill 1.02 pad 1.91)
  other vias: 32.61,79.25
N$72
  Top 0.508: R4.2 23.01,55.42 JP3.1
N$73  (via drill 1.02 pad 1.91)
  other vias: 14.83,64.01
N$74
  Top 0.254: U5.1 35.41,15.44 34.9,14.94 34.9,13.64 34.41,13.16 D11.K 34.63,12.89 R18.1
N$75
  Top 0.305: R12.2 LED2.A
N$76
  Top 0.254: JP8.1 R12.1
N$77
  Top 0.254: R17.2 31.19,32.22 31.19,22.81 33.31,20.69 LED4.A
N$78
  Top 0.254: JP11.1 R17.1
N$79  (via drill 1.02 pad 1.91)
  other vias: 12.29,76.71
N$80  (via drill 1.02 pad 1.91)
  other vias: 14.83,76.71
N$81  (via drill 1.02 pad 1.91)
  other vias: 17.37,76.71
N$82  (via drill 1.02 pad 1.91)
  other vias: 19.91,76.71
N$83  (via drill 1.02 pad 1.91)
  other vias: 22.45,76.71
N$84  (via drill 1.02 pad 1.91)
  other vias: 24.99,76.71
N$85  (via drill 1.02 pad 1.91)
  other vias: 27.53,76.71
N$86  (via drill 1.02 pad 1.91)
  other vias: 30.07,76.71
N$87  (via drill 1.02 pad 1.91)
  other vias: 37.69,76.71
N$88  (via drill 1.02 pad 1.91)
  other vias: 35.15,76.71
N$89  (via drill 1.02 pad 1.91)
  other vias: 32.61,76.71
N$90  (via drill 1.02 pad 1.91)
  other vias: 12.29,74.17
N$91  (via drill 1.02 pad 1.91)
  other vias: 14.83,74.17
N$92  (via drill 1.02 pad 1.91)
  other vias: 17.37,74.17
N$93  (via drill 1.02 pad 1.91)
  other vias: 19.91,74.17
N$94  (via drill 1.02 pad 1.91)
  other vias: 22.45,74.17
N$95  (via drill 1.02 pad 1.91)
  other vias: 24.99,74.17
N$96  (via drill 1.02 pad 1.91)
  other vias: 27.53,74.17
N$97  (via drill 1.02 pad 1.91)
  other vias: 30.07,74.17
N$98  (via drill 1.02 pad 1.91)
  other vias: 37.69,74.17
N$99  (via drill 1.02 pad 1.91)
  other vias: 35.15,74.17
N$100  (via drill 1.02 pad 1.91)
  other vias: 32.61,74.17
N$101  (via drill 1.02 pad 1.91)
  other vias: 12.29,71.63
N$102  (via drill 1.02 pad 1.91)
  other vias: 14.83,71.63
N$103  (via drill 1.02 pad 1.91)
  other vias: 17.37,71.63
N$104  (via drill 1.02 pad 1.91)
  other vias: 19.91,71.63
N$105  (via drill 1.02 pad 1.91)
  other vias: 22.45,71.63
N$106  (via drill 1.02 pad 1.91)
  other vias: 24.99,71.63
N$107  (via drill 1.02 pad 1.91)
  other vias: 27.53,71.63
N$108  (via drill 1.02 pad 1.91)
  other vias: 30.07,71.63
N$109  (via drill 1.02 pad 1.91)
  other vias: 37.69,71.63
N$110  (via drill 1.02 pad 1.91)
  other vias: 35.15,71.63
N$111  (via drill 1.02 pad 1.91)
  other vias: 32.61,71.63
N$112  (via drill 1.02 pad 1.91)
  other vias: 12.29,69.09
N$113  (via drill 1.02 pad 1.91)
  other vias: 14.83,69.09
N$114  (via drill 1.02 pad 1.91)
  other vias: 17.37,69.09
N$115  (via drill 1.02 pad 1.91)
  other vias: 19.91,69.09
N$116  (via drill 1.02 pad 1.91)
  other vias: 22.45,69.09
N$117  (via drill 1.02 pad 1.91)
  other vias: 24.99,69.09
N$118  (via drill 1.02 pad 1.91)
  other vias: 27.53,69.09
N$119  (via drill 1.02 pad 1.91)
  other vias: 30.07,69.09
N$120  (via drill 1.02 pad 1.91)
  other vias: 37.69,69.09
N$121  (via drill 1.02 pad 1.91)
  other vias: 35.15,69.09
N$122  (via drill 1.02 pad 1.91)
  other vias: 32.61,69.09
N$123  (via drill 1.02 pad 1.91)
  other vias: 12.29,66.55
N$124  (via drill 1.02 pad 1.91)
  other vias: 14.83,66.55
N$125  (via drill 1.02 pad 1.91)
  other vias: 17.37,66.55
N$126  (via drill 1.02 pad 1.91)
  other vias: 19.91,66.55
N$127  (via drill 1.02 pad 1.91)
  other vias: 22.45,66.55
N$128  (via drill 1.02 pad 1.91)
  other vias: 24.99,66.55
N$129  (via drill 1.02 pad 1.91)
  other vias: 27.53,66.55
N$130  (via drill 1.02 pad 1.91)
  other vias: 30.07,66.55
N$131  (via drill 1.02 pad 1.91)
  other vias: 37.69,66.55
N$132  (via drill 1.02 pad 1.91)
  other vias: 35.15,66.55
N$133  (via drill 1.02 pad 1.91)
  other vias: 32.61,66.55
N$134
  Top 0.483: C6.2 25.01,33.73 JP10.1
N$135  (via drill 1.02 pad 1.91)
  other vias: 17.37,64.01
N$138  (via drill 1.02 pad 1.91)
  other vias: 19.91,64.01
N$139  (via drill 1.02 pad 1.91)
  other vias: 22.45,64.01
N$140  (via drill 1.02 pad 1.91)
  other vias: 24.99,64.01
N$141  (via drill 1.02 pad 1.91)
  other vias: 27.53,64.01
N$142  (via drill 1.02 pad 1.91)
  other vias: 30.07,64.01
N$143  (via drill 1.02 pad 1.91)
  other vias: 37.69,64.01
N$144  (via drill 1.02 pad 1.91)
  other vias: 35.15,64.01
N$145  (via drill 1.02 pad 1.91)
  other vias: 32.61,64.01
N$146  (via drill 1.02 pad 1.91)
  other vias: 12.29,61.47
N$147  (via drill 1.02 pad 1.91)
  other vias: 14.83,61.47
N$148  (via drill 1.02 pad 1.91)
  other vias: 17.37,61.47
N$149  (via drill 1.02 pad 1.91)
  other vias: 19.91,61.47
N$150  (via drill 1.02 pad 1.91)
  other vias: 22.45,61.47
N$151  (via drill 1.02 pad 1.91)
  other vias: 24.99,61.47
N$152  (via drill 1.02 pad 1.91)
  other vias: 27.53,61.47
N$153  (via drill 1.02 pad 1.91)
  other vias: 30.07,61.47
N$154  (via drill 1.02 pad 1.91)
  other vias: 37.69,61.47
N$155  (via drill 1.02 pad 1.91)
  other vias: 35.15,61.47
N$156  (via drill 1.02 pad 1.91)
  other vias: 32.61,61.47
N$157  (via drill 1.02 pad 1.91)
  other vias: 12.29,58.93
N$158  (via drill 1.02 pad 1.91)
  other vias: 14.83,58.93
N$159  (via drill 1.02 pad 1.91)
  other vias: 17.37,58.93
N$160  (via drill 1.02 pad 1.91)
  other vias: 19.91,58.93
N$161  (via drill 1.02 pad 1.91)
  other vias: 22.45,58.93
N$162  (via drill 1.02 pad 1.91)
  other vias: 24.99,58.93
N$163  (via drill 1.02 pad 1.91)
  other vias: 27.53,58.93
N$164  (via drill 1.02 pad 1.91)
  other vias: 30.07,58.93
N$165  (via drill 1.02 pad 1.91)
  other vias: 37.69,58.93
N$166  (via drill 1.02 pad 1.91)
  other vias: 35.15,58.93
N$167  (via drill 1.02 pad 1.91)
  other vias: 32.61,58.93
N$169
  pour Top (no thermals): 28.14,21.69 29.87,21.69 29.92,21.74 29.92,25.3 29.87,25.35 28.19,25.35 28.09,25.25 28.09,21.74
N$170
  pour Top (no thermals): 24.54,25.35 26.26,25.35 26.31,25.3 26.31,21.74 26.26,21.69 24.54,21.69 24.49,21.74 24.49,25.3
PGOOD
  Top 1.27: J2.5 J3.5
RELAY_COIL
  Top 0.508: U4.3 40.01,35.59 X1.12
RELAY_COM
  Top 0.508: J9.1 37.6,26.27 39.11,27.79 X1.9
RELAY_EN  (via drill 0.35)
  Top 0.305: JP8.2 v36.37,40.34 37.05,40.34 37.47,39.91 U4.1 | SJ1.1 v10.52,49.38
  Bottom 0.254: v10.52,49.38 12.95,49.38 22.86,39.47 35.61,39.47 36.37,40.23 v36.37,40.34
RELAY_NC  (via drill 1 pad 1.78)
  Top 0.508: X1.10 40.54,30.33 41.86,29.01 v41.86,14.58
RELAY_NO  (via drill 1 pad 1.78)
  Top 0.508: X1.8 39.57,24.94 v39.57,14.53 39.57,5.13 J9.2
RS485_A
  Top 0.483: U3.6 31.9,50.72 30.55,50.72 R6.1
RS485_B
  Top 0.483: U3.7 31.9,50.06 30.65,50.06 R7.1
RS485_DE/!RE
  Top 0.254: JP6.2 35.72,54.7 35.57,54.55 | 35.57,54.55 35.92,54.2 35.92,51.82 36.7,51.03 U3.3 | U3.2 36.6,49.76 35.31,51.05 35.31,54.29 35.57,54.55
RTC_BAT
  Top 0.203: J4.23 42.37,67.76 JP2.2
  Top 1.27: J4.23 J5.23
RTC_EXTI
  Top 1.27: J4.24 J5.24
RUN
  Top 1.27: J2.6 J3.6
TSOM_A0_SDA  (via drill 0.35)
  Top 0.203: U2.5 43.16,77.61 40.08,74.54 40.08,59.23 38.46,57.61 14.94,57.61 13.58,56.25 J1.3 | 45.94,28.59 J4.9
  Top 0.254: J1.3 13.58,50.89 v13.61,50.85
  Top 1.27: J4.9 J5.9
  Bottom 0.254: J4.9 41.25,33.32 41.25,39.37 39.22,41.4 22.81,41.4 13.61,50.6 v13.61,50.85
TSOM_A1_SCL  (via drill 0.35)
  Top 0.203: 45.91,31.1 J4.10 | U2.6 44.42,78.21 40.54,74.32 40.54,58.62 38.96,57.05 15.49,57.05 14.58,56.13 J1.4
  Top 0.254: J1.4 14.58,51.77 v15.44,50.9
  Top 1.27: J4.10 J5.10
  Bottom 0.254: J4.10 42.52,34.59 42.52,39.73 39.98,42.27 23.42,42.27 15.44,50.24 v15.44,50.9
TSOM_A2_BUTTON
  Top 1.27: J4.11 J5.11
TSOM_A3_BATT_TEMP
  Top 1.27: J4.12 J5.12
TSOM_A4  (via drill 0.35)
  Top 0.254: JP6.1 34.49,54.81 v33.68,54.81
  Top 1.27: J2.9 J3.9
  Bottom 0.203: 4.07,28.61 J3.9
  Bottom 0.254: v33.68,54.81 33.68,54.86 31.34,57.2 13.51,57.2 7.87,51.56 7.87,32.41 4.07,28.61
TSOM_A5  (via drill 0.35)
  Top 0.254: J3.10 R14.1 v8.23,30.02 | U5.6 29.82,15.44 31.81,17.44 31.81,19.76 | 31.81,19.76 LED4.C | v30.89,19.81 31.76,19.81 31.81,19.76
  Top 1.27: J2.10 J3.10
  Bottom 0.254: v8.23,30.02 12.95,30.02 21.13,21.84 23.01,21.84 25.04,19.81 v30.89,19.81
TSOM_A6  (via drill 0.35)
  Top 0.254: D2.C 10.07,41.77 8.13,39.83 8.13,37.78 J3.11
  Top 0.483: D2.C 12.01,41.77 C4.1 13.36,41.8 R10.2 R11.1
  Top 0.508: D2.C v10.36,42.67
  Top 1.27: J2.11 J3.11
TSOM_A7
  Top 0.254: J3.12 6.81,39 6.81,40.39 10.25,43.83 D1.C
  Top 0.483: D1.C 12.01,43.83 C3.2 13.36,43.8 R9.1
  Top 1.27: J2.12 J3.12
TSOM_NFC2
  Top 0.305: SJ1.2 8.64,49.16 5.87,46.39 J3.16
  Top 1.27: J2.16 J3.16
TSOM_RX
  Top 0.254: U3.1 39.24,48.49 40.03,49.28 40.03,53.19 45.93,59.09 J4.21
  Top 1.27: J4.21 J5.21
TSOM_TX
  Top 0.254: U3.4 38.05,52.3 38.36,52.6 38.36,54.03 J4.22
  Top 1.27: J4.22 J5.22
TSOM_USB_N
  Top 1.27: J4.18 J5.18
TSOM_USB_P
  Top 1.27: J4.19 J5.19
TSOM_USB_VBUS
  Top 1.27: J4.3 J5.3
TSOM_VIN
  Top 1.27: J4.5 J5.5
VIN
  Top 0.61: CN1.8 PL1.1
  Top 1.524: J2.1 J3.1 6.77,8.29 6.86,8.38 | J2.2 J3.2 6.95,10.83 7.11,10.67
  pour Top (no thermals): 5.59,5.79 5.59,11.68 8.38,11.68 10.72,9.35 10.72,4.47 6.91,4.47

### Text on the board
tPlace: MONITOR ONE I/O PROTO CARD v0.0.4 | RESET | 3V3 | MODE | SDA | SCL | 3V3 | GP | EXTI | NC | RBAT | NC | TX | NC | RX | NC | GND | NC | USB+ | NC | GND | 3V3 | SDA | SCL | USB- | NC | GND | NFC2 | C5V | CAN 5V | NFC1 | CAN+ | !MODE | CAN- | RELAY | !RST | GND | A7 | A3 | A6 | A2 | A5 | A1 | A4 | A0 | GND | GND | 3V3 | VOUT | RUN | GND | INPUT | PG | TVIN | GND | GND | 485+ | 485- | CAN+ | CAN- | 0-10v | 4-20mA | GND | VBUS | VIN | GND | VIN | GND | VIN | INPUT | GND | COM | NO | LI+
tNames: U5